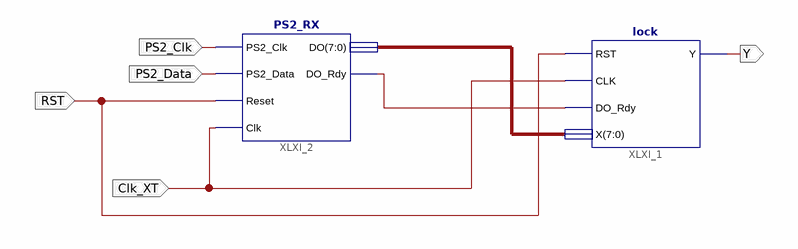
[diagram p0: schematic sheet 1]
// Xilinx ISE schematic locksch.sch (spartan3e) as structural Verilog: 2 symbols, 5 ports
module locksch (
  input  PS2_Clk,
  input  PS2_Data,
  input  Clk_XT,
  input  RST,
  output Y
);

  wire XLXN_6;
  wire [7:0] XLXN_5;

  lock XLXI_1 (.RST(RST), .CLK(Clk_XT), .DO_Rdy(XLXN_6), .X(XLXN_5), .Y(Y));
  PS2_RX XLXI_2 (.PS2_Clk(PS2_Clk), .PS2_Data(PS2_Data), .Clk(Clk_XT), .Reset(RST), .DO_Rdy(XLXN_6), .DO(XLXN_5));
endmodule
